# Altium schematic sheet Sch_TSAL.SchDoc
size A
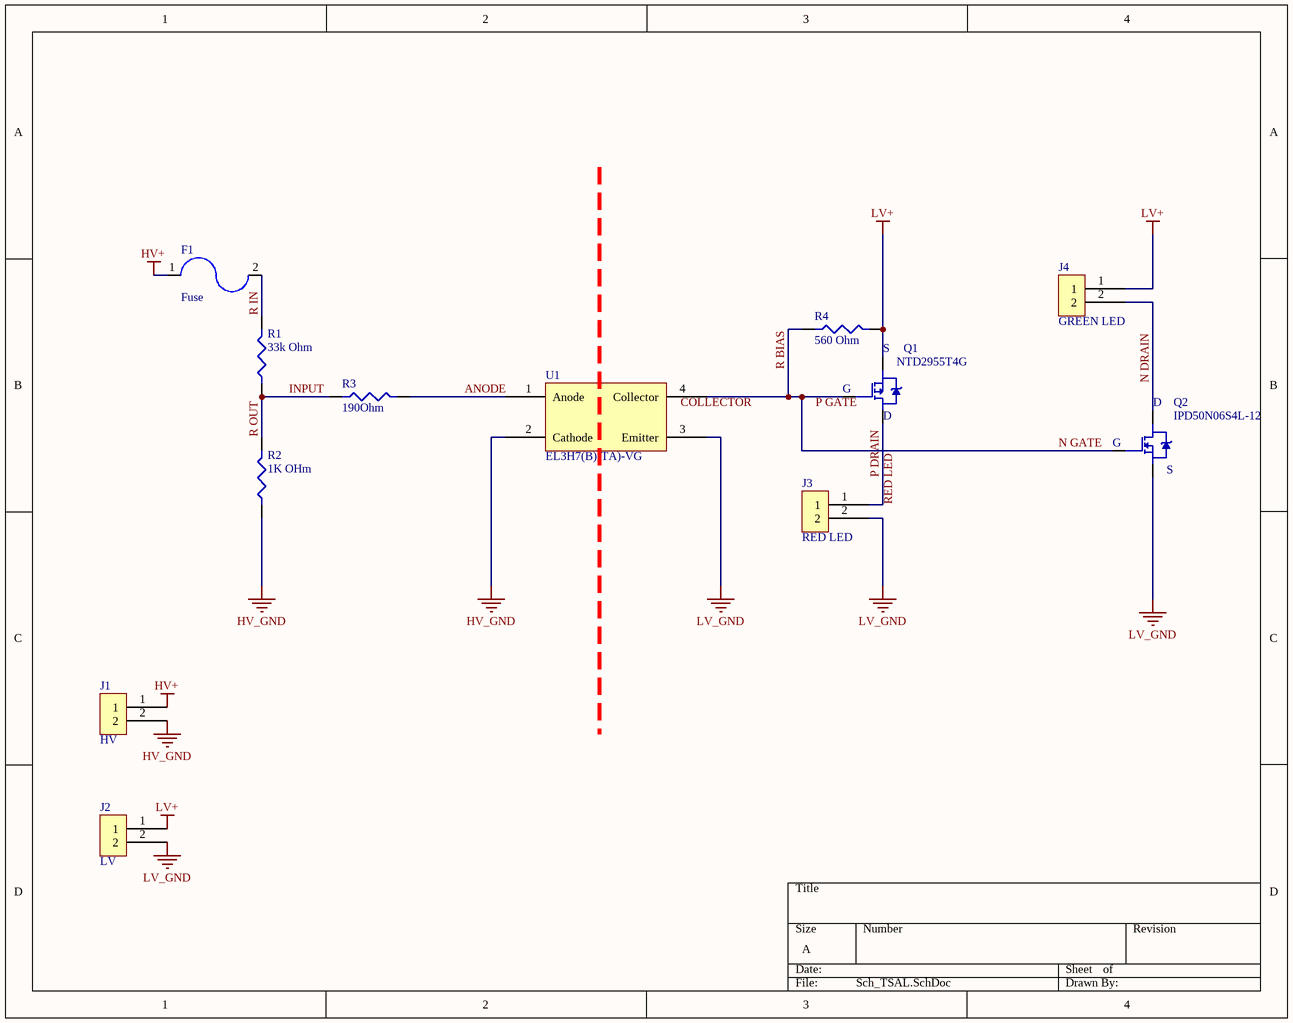
[diagram p0: Sch_TSAL.SchDoc]

## Parts
F1  Fuse  [FUSE_SMD]
J1  HV  [2_PIN_CONNECTOR]
J2  LV  [2_PIN_CONNECTOR]
J3  RED LED  [2_PIN_CONNECTOR]
J4  GREEN LED  [2_PIN_CONNECTOR]
Q1  NTD2955T4G  [DPAK228P991X238-3N]
Q2  IPD50N06S4L-12  [DPAK228P998X235-3N]
R1  33k Ohm  [RESC6332X07N]
R2  1K OHm  [RESC2012X06N]
R3  190Ohm  [RESC2012X06N]
R4  560 Ohm  [RESC2012X06N]
U1  EL3H7(B)(TA)-VG  [SOIC127P700X200-4N]

## Nets
HV+: F1.1 J1.1
HV_GND: J1.2 R2.1 U1.2(Cathode)
LV+: J2.1 J4.1 Q1.4 R4.2
LV_GND: J2.2 J3.2 Q2.3 U1.3(Emitter)
ANODE: R3.2 U1.1(Anode)
INPUT: R1.1 R2.2 R3.1  [also labelled R OUT]
N DRAIN: J4.2 Q2.4
N GATE: Q1.1 Q2.1 R4.1 U1.4(Collector)  [also labelled R BIAS]
P DRAIN: J3.1 Q1.3
R IN: F1.2 R1.2

## Notes on the sheet
- Labels drawn without touching a wire or pin: COLLECTOR, P GATE, RED LED
- (in symbol IPD50N06S4L-12) D; G; S
- (in symbol NTD2955T4G) S; G; D

## Library data of the parts
F1 = 0678D0800-02: Manufacturer: Bel; Fuse Type: Board Mount (Cartridge Style Excluded); Current Rating: 800mA; Voltage Rating (AC): 350V; Voltage Rating (DC): 250V; DC Cold Resistance: 380mR; Approvals: cURus; Supplier 1: Digi-Key; Manufacturer Part Number: 0678D0800-02; Stock 1: 2000; Pricing 1: 1=1.2, 5=1.164, 10=1.089, 50=0.901, 100=0.7508, 250=0.732, 500=0.61936, 1000=0.54429 (USD); Mount: Surface Mount; Case/Package: SMD/SMT; Min Operating Temperature: -55°C; Max Operating Temperature: 125°C; Packaging: Tape and Reel; Supplier Part Number 1: 507-2258-6-ND
J1-J4 = 0705530001: Manufacturer: Molex; Number of Positions: 2; Connector Type: Male Pin; Contact Resistance: 30mR; Pitch: 2.54mm; Supplier 1: Digi-Key; Manufacturer Part Number: 0705530001; Stock 1: 14591; Pricing 1: 1=0.71, 72=0.53486, 144=0.51264, 504=0.44575, 1008=0.36775, 5040=0.32318, 10008=0.30089 (USD); Mount: Through Hole; Color: Black; Housing Color: Black; Housing Material: Polyester; Contact Plating: Gold; Contact Material: Bronze; Min Operating Temperature: -40°C; Max Operating Temperature: 105°C; Number of Rows: 1; Packaging: Rail/Tube; Termination: Solder; Number of Contacts: 2; Orientation: Right Angle; Fastening Type: Latch; Length: 7.37mm; Depth: 13.59mm; Contact Mating Length: 0.24inch; Radiation Hardening: No; ComponentLink1URL: https://www.molex.com/pdm_docs/ps/PS-70400.pdf?src-supplier=Digi-Key; ComponentLink1Description: https://www.molex.com/pdm_docs/ps/PS-70400.pdf?src-supplier=Digi-Key; ComponentLink2URL: http://www.molex.com/webdocs/datasheets/pdf/en-us/0705530001_PCB_HEADERS.pdf?src-supplier=Avnet; ComponentLink2Description: http://www.molex.com/webdocs/datasheets/pdf/en-us/0705530001_PCB_HEADERS.pdf?src-supplier=Avnet; Supplier Part Number 1: WM4900-ND
Q1 = NTD2955T4G: Trans MOSFET P-CH 60V 12A 3-Pin(2+Tab) DPAK T/R; Manufacturer: ON Semiconductor; Rise Time: 45ns; Nominal Vgs: -2.8V; Input Capacitance: 750pF; Max Power Dissipation: 55W; Number of Elements: 1; Rds On Max: 180mR; Fall Time: 48ns; Drain to Source Resistance: 155mR; Turn-Off Delay Time: 26ns; Drain to Source Voltage (Vdss): -60V; Turn-On Delay Time: 10ns; Element Configuration: Single; Gate to Source Voltage (Vgs): 20V; Current Rating: -12A; Supplier 1: Digi-Key; Manufacturer Part Number: NTD2955T4G; Stock 1: 44767; Pricing 1: 1=1.04, 10=0.912, 100=0.7036, 500=0.52118, 1000=0.41694 (USD); Case/Package: DPAK; Number of Pins: 3; Contact Plating: Matte,Tin; Min Operating Temperature: -55°C; Max Operating Temperature: 175°C; Package Quantity: 1; Packaging: Tape and Reel; Power Dissipation: 55W; Continuous Drain Current (ID): 12A; Threshold Voltage: -2.8V; Drain to Source Breakdown Voltage: -60V; Voltage Rating (DC): -60V; On-State Resistance: 180mR; Number of Channels: 1; Length: 6.73mm; Height: 2.38mm; Width: 6.22mm; Radiation Hardening: No; REACH SVHC: No SVHC; Lead Free: Lead Free; ComponentLink1URL: http://www.onsemi.com/pub/Collateral/NTD2955-D.PDF?src-supplier=Avnet; ComponentLink1Description: http://www.onsemi.com/pub/Collateral/NTD2955-D.PDF?src-supplier=Avnet; ComponentLink2URL: http://www.onsemi.com/pub/Collateral/NTD2955-D.PDF?src-supplier=Avnet+Europe; ComponentLink2Description: http://www.onsemi.com/pub/Collateral/NTD2955-D.PDF?src-supplier=Avnet+Europe; ComponentLink3URL: http://www.onsemi.com/pub_link/Collateral/NTD2955-D.PDF?src-supplier=Element14; ComponentLink3Description: http://www.onsemi.com/pub_link/Collateral/NTD2955-D.PDF?src-supplier=Element14; ComponentLink4URL: http://www.onsemi.com/pub/Collateral/NTD2955-D.PDF?src-supplier=Digi-Key; ComponentLink4Description: http://www.onsemi.com/pub/Collateral/NTD2955-D.PDF?src-supplier=Digi-Key; ComponentLink5URL: http://www.jameco.com/Jameco/Products/ProdDS/1178118.pdf?src-supplier=Jameco; ComponentLink5Description: http://www.jameco.com/Jameco/Products/ProdDS/1178118.pdf?src-supplier=Jameco; Supplier Part Number 1: NTD2955T4GOSCT-ND
Q2 = IPD50N06S4L-12: MOSFET N-CH 60V 50A TO252-3-11; Manufacturer: Infineon; Rise Time: 2ns; Input Capacitance: 2.89nF; Rds On Max: 12mR; Max Power Dissipation: 50W; Turn-On Delay Time: 6ns; Turn-Off Delay Time: 25ns; Fall Time: 5ns; Drain to Source Resistance: 21.6mR; Element Configuration: Single; Gate to Source Voltage (Vgs): 16V; Supplier 1: Digi-Key; Manufacturer Part Number: IPD50N06S4L-12; Stock 1: 0; Pricing 1: 1=0.78, 10=0.689, 100=0.5268, 500=0.41736, 1000=0.33429 (USD); Case/Package: TO-252-3; Number of Pins: 3; Min Operating Temperature: -55°C; Max Operating Temperature: 175°C; Package Quantity: 2500; Packaging: Tape and Reel; Max Dual Supply Voltage: 60V; Drain to Source Voltage (Vdss): 60V; Continuous Drain Current (ID): 50A; Length: 6.5mm; Height: 2.3mm; Width: 6.22mm; Halogen Free: Halogen Free; Lead Free: Lead Free; ComponentLink1URL: http://www.infineon.com/dgdl/Infineon-IPD50N06S4L_12-DS-v01_00-en.pdf?folderId=db3a30431a5c32f2011a8084a04a6500&fileId=db3a30431ff9881501203885cc580ca0&ack=t&src-supplier=Digi-Key; ComponentLink1Description: http://www.infineon.com/dgdl/Infineon-IPD50N06S4L_12-DS-v01_00-en.pdf?folderId=db3a30431a5c32f2011a8084a04a6500&fileId=db3a30431ff9881501203885cc580ca0&ack=t&src-supplier=Digi-Key; Supplier Part Number 1: IPD50N06S4L12ATMA1CT-ND
R1 = RMCF2512JT33K0: RES SMD 33K OHM 5% 1W 2512; Manufacturer: Stackpole Electronics; Resistance: 33kR; Temperature Coefficient: 100ppm/°C; Supplier 1: Digi-Key; Manufacturer Part Number: RMCF2512JT33K0; Stock 1: 37651; Pricing 1: 1=0.3, 10=0.254, 100=0.0993, 1000=0.04158 (USD); Mount: Surface Mount; Case/Package: 2512; Case Code (Metric): 6432; Case Code (Imperial): 2512; Contact Plating: Tin,Matte; Min Operating Temperature: -55°C; Max Operating Temperature: 155°C; Tolerance: 5%; Power Rating: 1W; Packaging: Tape and Reel; Composition: Thick Film; Number of Terminations: 2; Max Power Dissipation: 1W; Features: Automotive AEC-Q200; Length: 0.248inch; Height: 0.028inch; Width: 0.126inch; Radiation Hardening: No; Lead Free: Lead Free; Supplier Part Number 1: RMCF2512JT33K0CT-ND
R2 = RNCP0805FTD1K00: RES 1K OHM 1% 1/4W 0805; Manufacturer: Stackpole Electronics; Resistance: 1kR; Power Rating: 250mW; Temperature Coefficient: 100ppm/°C; Supplier 1: Digi-Key; Manufacturer Part Number: RNCP0805FTD1K00; Stock 1: 903429; Pricing 1: 1=0.1, 10=0.072, 100=0.0277, 1000=0.0122, 2500=0.01053 (USD); Mount: Surface Mount; Case/Package: 0805; Case Code (Metric): 2012; Case Code (Imperial): 0805; Min Operating Temperature: -55°C; Max Operating Temperature: 155°C; Tolerance: 1%; Packaging: Tape and Reel; Composition: Thin Film; Number of Terminations: 2; Max Power Dissipation: 250mW; Features: Moisture Resistant,Anti-Sulfur; Length: 0.079inch; Height: 0.024inch; Width: 0.049inch; Lead Free: Lead Free; Supplier Part Number 1: RNCP0805FTD1K00DKR-ND
R3 = RC0805FR-0719R1L: Manufacturer: Yageo; Resistance: 19.1R; Tolerance: 1%; Temperature Coefficient: 100ppm/°C; Voltage Rating (DC): 150V; Power Rating: 125mW; Supplier 1: Digi-Key; Manufacturer Part Number: RC0805FR-0719R1L; Stock 1: 17015; Pricing 1: 1=0.1, 10=0.042, 100=0.017, 1000=0.00762, 2500=0.00662 (USD); Case/Package: 0805; Case Code (Imperial): 0805; Case Code (Metric): 2012; Contact Plating: Tin,Matte; Min Operating Temperature: -55°C; Max Operating Temperature: 155°C; Packaging: Tape and Reel; Composition: Thick Film; Voltage Rating: 150V; Termination: SMD/SMT; Military Standard: Not; Length: 2mm; Height: 0.5mm; Width: 1.25mm; Depth: 1.25mm; Radiation Hardening: No; Lead Free: Lead Free; Supplier Part Number 1: 311-19.1CRCT-ND
R4 = ESR10EZPJ561: RES SMD 560 OHM 5% 0.4W 0805; Manufacturer: Rohm; Resistance: 560R; Power Rating: 250mW; Temperature Coefficient: 200ppm/°C; Max Power Dissipation: 400mW; Supplier 1: Digi-Key; Manufacturer Part Number: ESR10EZPJ561; Stock 1: 10361; Pricing 1: 1=0.1, 10=0.083, 100=0.0318, 1000=0.01398, 2500=0.01207 (USD); Case/Package: 0805; Case Code (Metric): 2012; Case Code (Imperial): 0805; Min Operating Temperature: -55°C; Max Operating Temperature: 155°C; Tolerance: 5%; Package Quantity: 1; Packaging: Tape and Reel; Composition: Thick Film; Number of Terminations: 2; Features: Automotive AEC-Q200; Length: 0.079inch; Height: 0.026inch; Width: 0.049inch; Lead Free: Lead Free; ComponentLink1URL: http://www.rohm.com/web/global/datasheet/ESR01MZPF/esr-e?src-supplier=Digi-Key; ComponentLink1Description: http://www.rohm.com/web/global/datasheet/ESR01MZPF/esr-e?src-supplier=Digi-Key; ComponentLink2URL: https://www.rohm.com/datasheet/ESR01MZPF/esr-e?src-supplier=Digi-Key; ComponentLink2Description: https://www.rohm.com/datasheet/ESR01MZPF/esr-e?src-supplier=Digi-Key; ComponentLink3URL: http://www1.futureelectronics.com/doc/ROHM%20SEMICONDUCTOR/ESR10EZPD.pdf?src-supplier=Future+Electronics; ComponentLink3Description: http://www1.futureelectronics.com/doc/ROHM%20SEMICONDUCTOR/ESR10EZPD.pdf?src-supplier=Future+Electronics; Supplier Part Number 1: RHM560KDKR-ND
U1 = EL3H7(B)(TA)-VG: OPTOISOLATOR 3.75KV TRANS 4-SSOP; Manufacturer: Everlight; Number of Channels: 1; Collector Emitter Voltage (VCEO): 80V; Max Power Dissipation: 200mW; Forward Current: 50mA; Forward Voltage: 1.4V; Reverse Breakdown Voltage: 6V; Rise Time: 18000ns; Collector Emitter Saturation Voltage: 200mV; Current Transfer Ratio: 260%; Approvals: UL; Supplier 1: Digi-Key; Manufacturer Part Number: EL3H7(B)(TA)-VG; Stock 1: 119652; Pricing 1: 1=0.42, 10=0.304, 25=0.248, 100=0.1985, 250=0.16752, 500=0.1427, 1000=0.11167, 2500=0.10237 (USD); Mount: Surface Mount; Case/Package: SSOP; Number of Pins: 4; Min Operating Temperature: -55°C; Max Operating Temperature: 125°C; Packaging: Tape and Reel; Package Quantity: 1; Max Output Voltage: 80V; Output Current per Channel: 50mA; Max Input Current: 50mA; Max Collector Current: 50mA; Fall Time: 18000ns; Isolation Voltage: 3.75kV; Number of Elements: 1; Power Dissipation: 200mW; Collector Emitter Breakdown Voltage: 80V; Radiation Hardening: No; Lead Free: Lead Free; ComponentLink1URL: https://everlightamericas.com/index.php?controller=attachment&id_attachment=2584&src-supplier=Digi-Key; ComponentLink1Description: https://everlightamericas.com/index.php?controller=attachment&id_attachment=2584&src-supplier=Digi-Key; ComponentLink2URL: https://everlightamericas.com/index.php?controller=attachment&amp;id_attachment=2584&src-supplier=Digi-Key; ComponentLink2Description: https://everlightamericas.com/index.php?controller=attachment&amp;id_attachment=2584&src-supplier=Digi-Key; ComponentLink3URL: https://www.verical.com/server-webapp/html/getDatasheet?partID=416716&src-supplier=Verical; ComponentLink3Description: https://www.verical.com/server-webapp/html/getDatasheet?partID=416716&src-supplier=Verical; Supplier Part Number 1: 1080-1197-6-ND